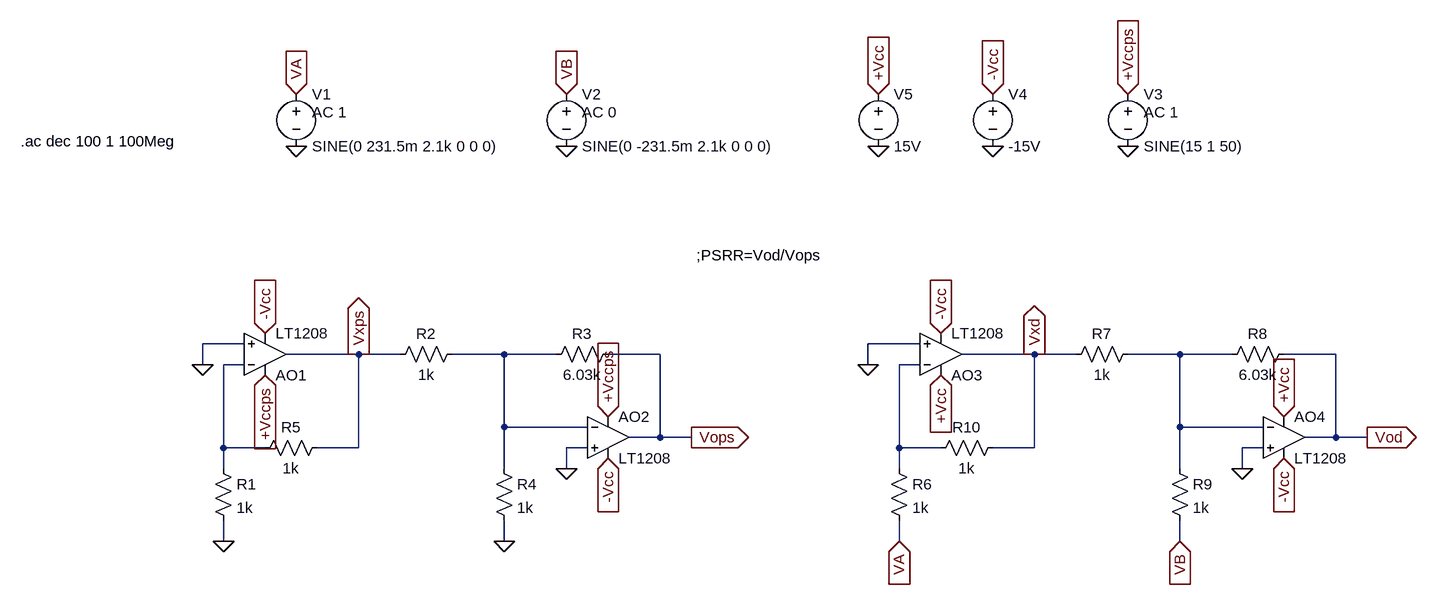
[diagram p0: schematic PSRR_Etaj_I.asc]
PSRR_Etaj_I.asc, the LTspice schematic file:
Version 4.1
SHEET 1 1836 680
WIRE -144 64 -208 64
WIRE 896 64 816 64
WIRE 32 80 -80 80
WIRE 96 80 32 80
WIRE 256 80 176 80
WIRE 336 80 256 80
WIRE 496 80 416 80
WIRE 1072 80 960 80
WIRE 1136 80 1072 80
WIRE 1296 80 1216 80
WIRE 1376 80 1296 80
WIRE 1536 80 1456 80
WIRE -208 96 -208 64
WIRE -144 96 -176 96
WIRE 816 96 816 64
WIRE 896 96 864 96
WIRE 256 192 256 80
WIRE 384 192 256 192
WIRE 1296 192 1296 80
WIRE 1424 192 1296 192
WIRE 496 208 496 80
WIRE 496 208 448 208
WIRE 544 208 496 208
WIRE 1536 208 1536 80
WIRE 1536 208 1488 208
WIRE 1584 208 1536 208
WIRE -176 224 -176 96
WIRE -112 224 -176 224
WIRE 32 224 32 80
WIRE 32 224 -32 224
WIRE 384 224 352 224
WIRE 864 224 864 96
WIRE 928 224 864 224
WIRE 1072 224 1072 80
WIRE 1072 224 1008 224
WIRE 1424 224 1392 224
WIRE -176 256 -176 224
WIRE 256 256 256 192
WIRE 352 256 352 224
WIRE 864 256 864 224
WIRE 1296 256 1296 192
WIRE 1392 256 1392 224
WIRE -176 368 -176 336
WIRE 256 368 256 336
WIRE 864 368 864 336
WIRE 1296 368 1296 336
FLAG -208 96 0
FLAG 352 256 0
FLAG 544 208 Vops
IOPIN 544 208 Out
FLAG -112 48 -Vcc
IOPIN -112 48 In
FLAG 416 240 -Vcc
IOPIN 416 240 In
FLAG 32 80 Vxps
IOPIN 32 80 Out
FLAG -64 -240 0
FLAG 352 -240 0
FLAG -64 -320 VA
IOPIN -64 -320 In
FLAG 352 -320 VB
IOPIN 352 -320 In
FLAG 1216 -320 +Vccps
IOPIN 1216 -320 In
FLAG 1008 -320 -Vcc
IOPIN 1008 -320 In
FLAG 1216 -240 0
FLAG 1008 -240 0
FLAG 816 96 0
FLAG 1392 256 0
FLAG 1296 368 VB
IOPIN 1296 368 In
FLAG 864 368 VA
IOPIN 864 368 In
FLAG 1584 208 Vod
IOPIN 1584 208 Out
FLAG 928 112 +Vcc
IOPIN 928 112 In
FLAG 1456 176 +Vcc
IOPIN 1456 176 In
FLAG 928 48 -Vcc
IOPIN 928 48 In
FLAG 1456 240 -Vcc
IOPIN 1456 240 In
FLAG 1072 80 Vxd
IOPIN 1072 80 Out
FLAG 832 -320 +Vcc
IOPIN 832 -320 In
FLAG 832 -240 0
FLAG -112 112 +Vccps
IOPIN -112 112 In
FLAG 416 176 +Vccps
IOPIN 416 176 In
FLAG -176 368 0
FLAG 256 368 0
SYMBOL OpAmps\\LT1208 -112 144 M180
SYMATTR InstName AO1
SYMBOL res -192 240 R0
SYMATTR InstName R1
SYMATTR Value 1k
SYMBOL res 80 96 R270
WINDOW 0 32 56 VTop 2
WINDOW 3 0 56 VBottom 2
SYMATTR InstName R2
SYMATTR Value 1k
SYMBOL res 320 96 R270
WINDOW 0 32 56 VTop 2
WINDOW 3 0 56 VBottom 2
SYMATTR InstName R3
SYMATTR Value 6.03k
SYMBOL res 240 240 R0
SYMATTR InstName R4
SYMATTR Value 1k
SYMBOL OpAmps\\LT1208 416 144 R0
SYMATTR InstName AO2
SYMBOL res -128 240 R270
WINDOW 0 32 56 VTop 2
WINDOW 3 0 56 VBottom 2
SYMATTR InstName R5
SYMATTR Value 1k
SYMBOL voltage -64 -336 R0
WINDOW 123 24 44 Left 2
WINDOW 39 0 0 Left 0
SYMATTR Value2 AC 1
SYMATTR InstName V1
SYMATTR Value SINE(0 231.5m 2.1k 0 0 0)
SYMBOL voltage 352 -336 R0
WINDOW 123 24 44 Left 2
WINDOW 39 0 0 Left 0
SYMATTR Value2 AC 0
SYMATTR InstName V2
SYMATTR Value SINE(0 -231.5m 2.1k 0 0 0)
SYMBOL voltage 1216 -336 R0
WINDOW 123 24 44 Left 2
WINDOW 39 0 0 Left 0
SYMATTR Value2 AC 1
SYMATTR InstName V3
SYMATTR Value SINE(15 1 50)
SYMBOL voltage 1008 -336 R0
WINDOW 123 24 44 Left 2
WINDOW 39 0 0 Left 0
SYMATTR InstName V4
SYMATTR Value -15V
SYMBOL OpAmps\\LT1208 928 144 M180
SYMATTR InstName AO3
SYMBOL res 848 240 R0
SYMATTR InstName R6
SYMATTR Value 1k
SYMBOL res 1120 96 R270
WINDOW 0 32 56 VTop 2
WINDOW 3 0 56 VBottom 2
SYMATTR InstName R7
SYMATTR Value 1k
SYMBOL res 1360 96 R270
WINDOW 0 32 56 VTop 2
WINDOW 3 0 56 VBottom 2
SYMATTR InstName R8
SYMATTR Value 6.03k
SYMBOL res 1280 240 R0
SYMATTR InstName R9
SYMATTR Value 1k
SYMBOL OpAmps\\LT1208 1456 144 R0
SYMATTR InstName AO4
SYMBOL res 912 240 R270
WINDOW 0 32 56 VTop 2
WINDOW 3 0 56 VBottom 2
SYMATTR InstName R10
SYMATTR Value 1k
SYMBOL voltage 832 -336 R0
WINDOW 123 24 44 Left 2
WINDOW 39 0 0 Left 0
SYMATTR InstName V5
SYMATTR Value 15V
TEXT -488 -248 Left 2 !.ac dec 100 1 100Meg
TEXT 552 -72 Left 2 !;PSRR=Vod/Vops

The netlist it stands for:
* PSRR_Etaj_I.asc
X§AO1 0 N003 +Vccps -Vcc Vxps LT1208  ; pins In+ In- V+ V- OUT
R1 N003 0 1k
R2 Vxps N001 1k
R3 N001 Vops 6.03k
R4 N001 0 1k
X§AO2 0 N001 +Vccps -Vcc Vops LT1208  ; pins In+ In- V+ V- OUT
R5 N003 Vxps 1k
V1 VA 0 SINE(0 231.5m 2.1k 0 0 0) AC 1
V2 VB 0 SINE(0 -231.5m 2.1k 0 0 0) AC 0
V3 +Vccps 0 SINE(15 1 50) AC 1
V4 -Vcc 0 -15V
X§AO3 0 N004 +Vcc -Vcc Vxd LT1208  ; pins In+ In- V+ V- OUT
R6 N004 VA 1k
R7 Vxd N002 1k
R8 N002 Vod 6.03k
R9 N002 VB 1k
X§AO4 0 N002 +Vcc -Vcc Vod LT1208  ; pins In+ In- V+ V- OUT
R10 N004 Vxd 1k
V5 +Vcc 0 15V
.ac dec 100 1 100Meg
;PSRR=Vod/Vops
.backanno
.end